# EAGLE design stm32f76XV_breakout (EAGLE 8.0.0)

## Sheet 1 of 2: STM32F4
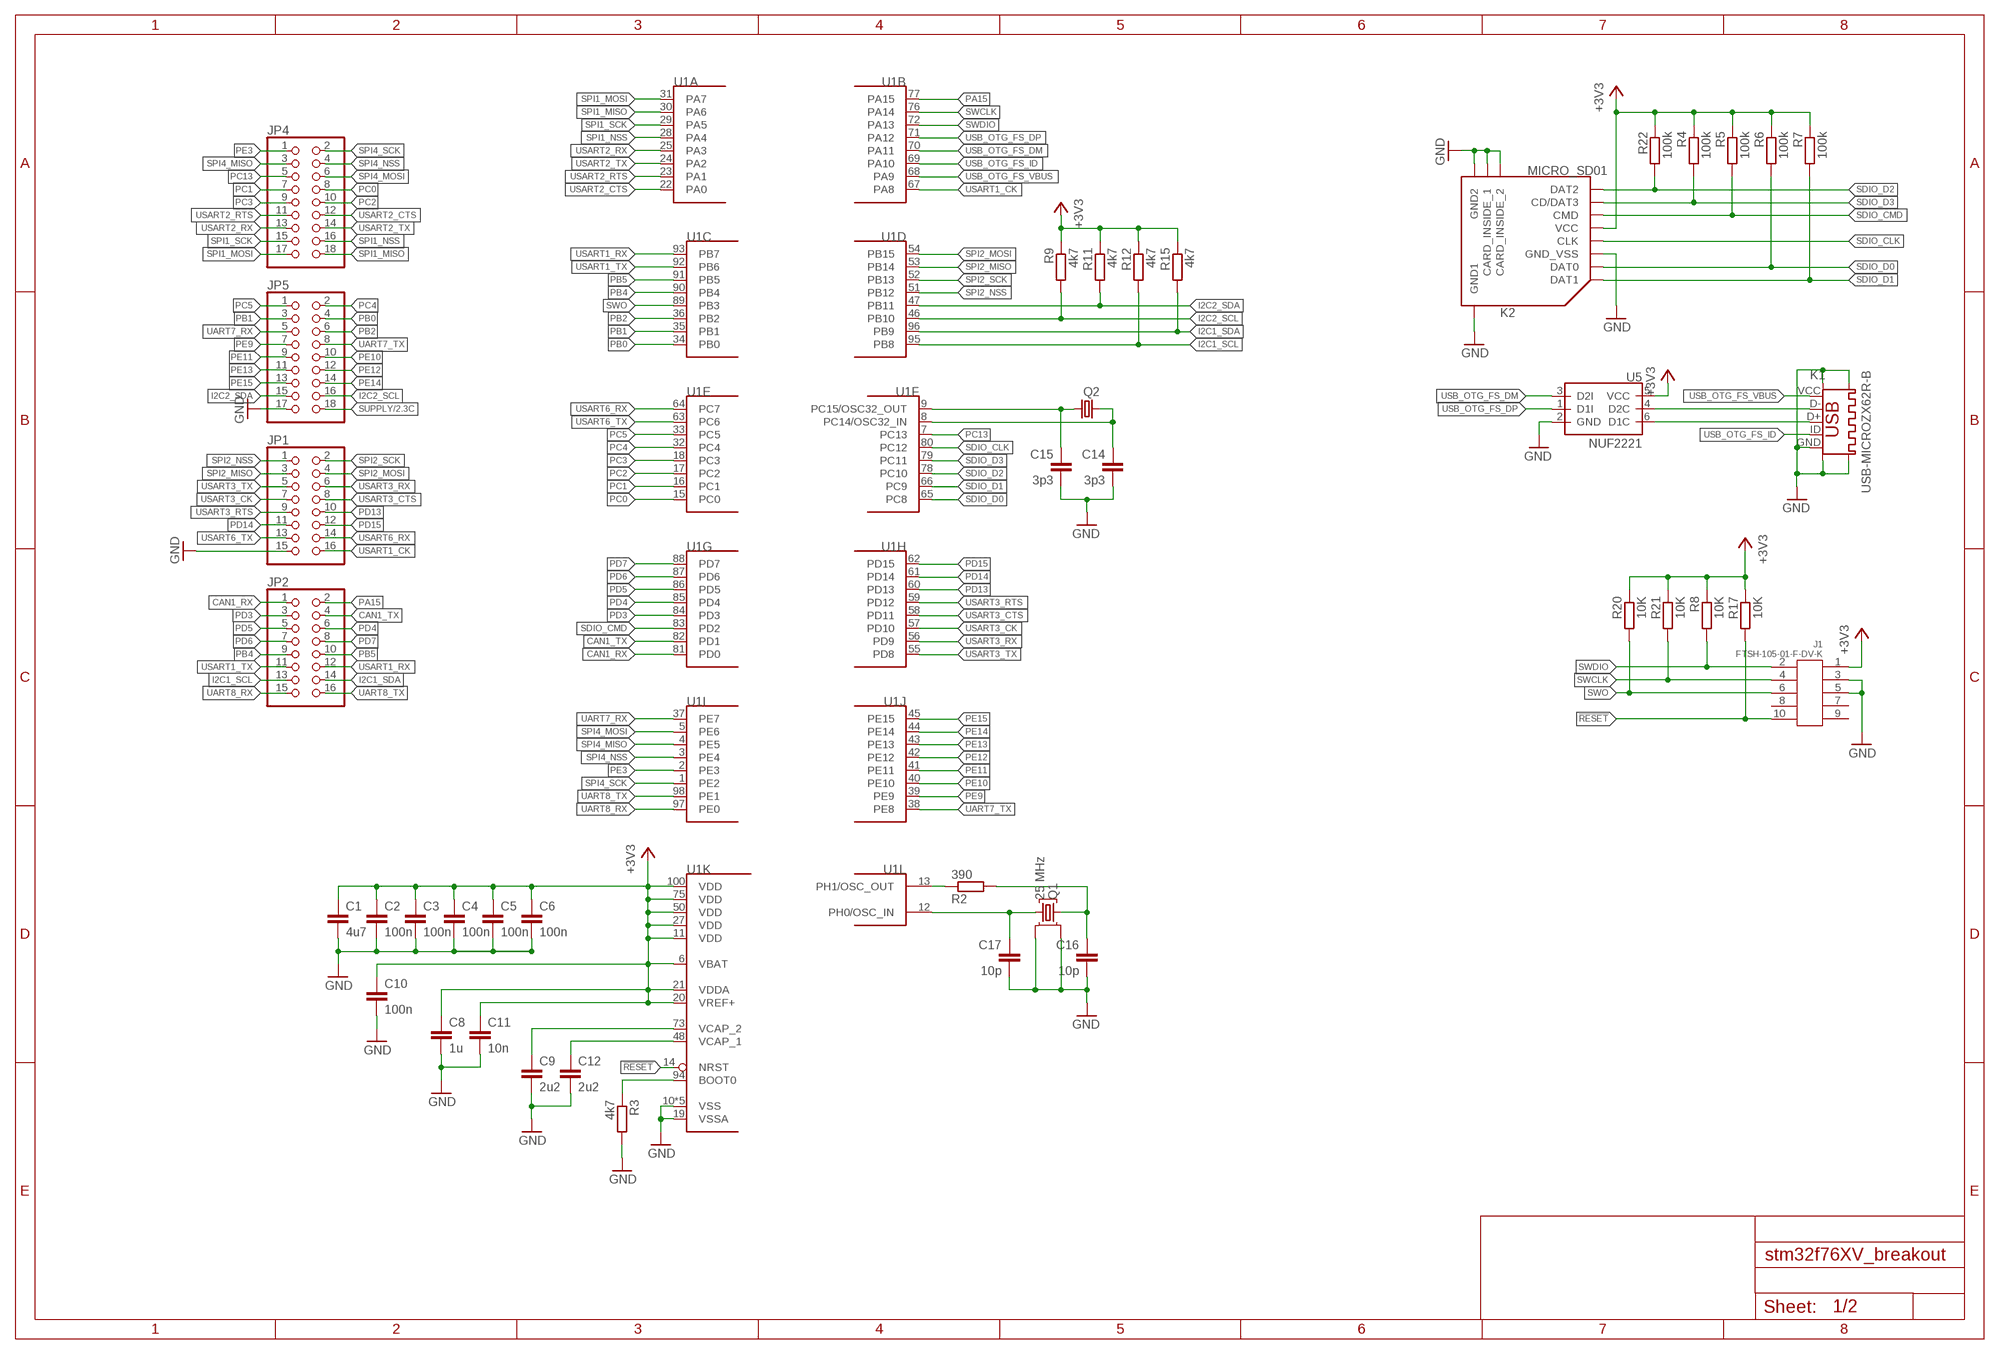
[diagram p0: schematic, sheet 1]

### Parts
C1  4u7  C-EUC0603  [C0603]
C2  100n  C-EUC0603  [C0603]
C3  100n  C-EUC0603  [C0603]
C4  100n  C-EUC0603  [C0603]
C5  100n  C-EUC0603  [C0603]
C6  100n  C-EUC0603  [C0603]
C8  1u  C-EUC0603  [C0603]
C9  2u2  C-EUC0603  [C0603]
C10  100n  C-EUC0603  [C0603]
C11  10n  C-EUC0603  [C0603]
C12  2u2  C-EUC0603  [C0603]
C14  3p3  C-EUC0603  [C0603]
C15  3p3  C-EUC0603  [C0603]
C16  10p  C-EUC0603  [C0603]
C17  10p  C-EUC0603  [C0603]
J1  FTSH-105-01-F-DV-K  [FTSH-105-01-XXX-DV-K]
JP1  PINHD-2X8  [2X08]
JP2  PINHD-2X8  [2X08]
JP4  PINHD-2X9  [2X09]
JP5  PINHD-2X9  [2X09]
K1  USB-MICROZX62R-B  [ZX62R-B]
K2  MICRO_SD01  [MICRO_SD_473093751]
Q1  25 MHz  CRYSTAL2M_CX32  [3.2X2.5MM-SMD]
Q2  CRYSTAL_ECX-34S  [3.2X1.5MM-SMD]
R2  390  R-EU_R0603  [R0603]
R3  4k7  R-EU_R0603  [R0603]
R4  100k  R-EU_R0603  [R0603]
R5  100k  R-EU_R0603  [R0603]
R6  100k  R-EU_R0603  [R0603]
R7  100k  R-EU_R0603  [R0603]
R8  10K  R-EU_R0603  [R0603]
R9  4k7  R-EU_R0603  [R0603]
R11  4k7  R-EU_R0603  [R0603]
R12  4k7  R-EU_R0603  [R0603]
R15  4k7  R-EU_R0603  [R0603]
R17  10K  R-EU_R0603  [R0603]
R20  10K  R-EU_R0603  [R0603]
R21  10K  R-EU_R0603  [R0603]
R22  100k  R-EU_R0603  [R0603]
U1  STM32F76XVXT  [LQFP-100_14X14MM]
U5  NUF2221  [SOT363]

### Nets
!RESET: J1.10 R17.2 U1.14(K:NRST)
+3V3: C1.1 C2.1 C3.1 C4.1 C5.1 C6.1 C8.1 C10.1 C11.1 J1.1 K2.VCC R4.1 R5.1 R6.1 R7.1 R8.1 R9.1 R11.1 R12.1 R15.1 R17.1 R20.1 R21.1 R22.1 U1.6(K:VBAT) U1.11(K:VDD) U1.20(K:VREF+) U1.21(K:VDDA) U1.27(K:VDD) U1.50(K:VDD) U1.75(K:VDD) U1.100(K:VDD) U5.5(VCC) ; also sheet 2
CAN1_RX: JP2.1 U1.81(G:PD0)
CAN1_TX: JP2.4 U1.82(G:PD1)
GND: C1.2 C2.2 C3.2 C4.2 C5.2 C6.2 C8.2 C9.2 C10.2 C11.2 C12.2 C14.2 C15.2 C16.2 C17.2 J1.3 J1.5 JP1.15 JP5.17 K1.GND K1.P$6(GND3) K1.P$7(GND4) K1.P$8(GND1) K1.P$9(GND2) K2.C_SW1(CARD_INSIDE_1) K2.C_SW2(CARD_INSIDE_2) K2.GND1 K2.GND2 K2.GND_VSS Q1.2(GND1) Q1.4(GND2) R3.2 U1.10(K:VSS) U1.19(K:VSSA) U1.26(K:VSS) U1.49(K:VSS) U1.74(K:VSS) U1.99(K:VSS) U5.2(GND) ; also sheet 2
I2C1_SCL: JP2.13 R12.2 U1.95(D:PB8)
I2C1_SDA: JP2.14 R15.2 U1.96(D:PB9)
I2C2_SCL: JP5.16 R9.2 U1.46(D:PB10)
I2C2_SDA: JP5.15 R11.2 U1.47(D:PB11)
N$1: C9.1 U1.73(K:VCAP_2)
N$2: C12.1 U1.48(K:VCAP_1)
N$3: R2.1 U1.13(L:PH1/OSC_OUT)
N$4: C17.1 Q1.3(Q2) U1.12(L:PH0/OSC_IN)
N$6: R3.1 U1.94(K:BOOT0)
N$21: C15.1 Q2.Q2 U1.9(F:PC15/OSC32_OUT)
N$22: C14.1 Q2.Q1 U1.8(F:PC14/OSC32_IN)
N$24: C16.1 Q1.1(Q1) R2.2
PA15: JP2.2 U1.77(B:PA15)
PB0: JP5.4 U1.34(C:PB0)
PB1: JP5.3 U1.35(C:PB1)
PB2: JP5.6 U1.36(C:PB2)
PB4: JP2.9 U1.90(C:PB4)
PB5: JP2.10 U1.91(C:PB5)
PC0: JP4.8 U1.15(E:PC0)
PC1: JP4.7 U1.16(E:PC1)
PC2: JP4.10 U1.17(E:PC2)
PC3: JP4.9 U1.18(E:PC3)
PC4: JP5.2 U1.32(E:PC4)
PC5: JP5.1 U1.33(E:PC5)
PC13: JP4.5 U1.7(F:PC13)
PD3: JP2.3 U1.84(G:PD3)
PD4: JP2.6 U1.85(G:PD4)
PD5: JP2.5 U1.86(G:PD5)
PD6: JP2.7 U1.87(G:PD6)
PD7: JP2.8 U1.88(G:PD7)
PD13: JP1.10 U1.60(H:PD13)
PD14: JP1.11 U1.61(H:PD14)
PD15: JP1.12 U1.62(H:PD15)
PE3: JP4.1 U1.2(I:PE3)
PE9: JP5.7 U1.39(J:PE9)
PE10: JP5.10 U1.40(J:PE10)
PE11: JP5.9 U1.41(J:PE11)
PE12: JP5.12 U1.42(J:PE12)
PE13: JP5.11 U1.43(J:PE13)
PE14: JP5.14 U1.44(J:PE14)
PE15: JP5.13 U1.45(J:PE15)
SDIO_CLK: K2.CLK U1.80(F:PC12)
SDIO_CMD: K2.CMD R5.2 U1.83(G:PD2)
SDIO_D0: K2.DAT0 R6.2 U1.65(F:PC8)
SDIO_D1: K2.DAT1 R7.2 U1.66(F:PC9)
SDIO_D2: K2.DAT2 R22.2 U1.78(F:PC10)
SDIO_D3: K2.CD/DAT3 R4.2 U1.79(F:PC11)
SPI1_MISO: JP4.18 U1.30(A:PA6)
SPI1_MOSI: JP4.17 U1.31(A:PA7)
SPI1_NSS: JP4.16 U1.28(A:PA4)
SPI1_SCK: JP4.15 U1.29(A:PA5)
SPI2_MISO: JP1.3 U1.53(D:PB14)
SPI2_MOSI: JP1.4 U1.54(D:PB15)
SPI2_NSS: JP1.1 U1.51(D:PB12)
SPI2_SCK: JP1.2 U1.52(D:PB13)
SPI4_MISO: JP4.3 U1.4(I:PE5)
SPI4_MOSI: JP4.6 U1.5(I:PE6)
SPI4_NSS: JP4.4 U1.3(I:PE4)
SPI4_SCK: JP4.2 U1.1(I:PE2)
SUPPLY: JP5.18 ; also sheet 2
SWCLK: J1.4 R21.2 U1.76(B:PA14)
SWDIO: J1.2 R8.2 U1.72(B:PA13)
SWO: J1.6 R20.2 U1.89(C:PB3)
UART7_RX: JP5.5 U1.37(I:PE7)
UART7_TX: JP5.8 U1.38(J:PE8)
UART8_RX: JP2.15 U1.97(I:PE0)
UART8_TX: JP2.16 U1.98(I:PE1)
USART1_CK: JP1.16 U1.67(B:PA8)
USART1_RX: JP2.12 U1.93(C:PB7)
USART1_TX: JP2.11 U1.92(C:PB6)
USART2_CTS: JP4.12 U1.22(A:PA0)
USART2_RTS: JP4.11 U1.23(A:PA1)
USART2_RX: JP4.13 U1.25(A:PA3)
USART2_TX: JP4.14 U1.24(A:PA2)
USART3_CK: JP1.7 U1.57(H:PD10)
USART3_CTS: JP1.8 U1.58(H:PD11)
USART3_RTS: JP1.9 U1.59(H:PD12)
USART3_RX: JP1.6 U1.56(H:PD9)
USART3_TX: JP1.5 U1.55(H:PD8)
USART6_RX: JP1.14 U1.64(E:PC7)
USART6_TX: JP1.13 U1.63(E:PC6)
USB_DM: K1.D- U5.4(D2C)
USB_DP: K1.D+ U5.6(D1C)
USB_OTG_FS_DM: U1.70(B:PA11) U5.3(D2I)
USB_OTG_FS_DP: U1.71(B:PA12) U5.1(D1I)
USB_OTG_FS_ID: K1.ID U1.69(B:PA10)
USB_OTG_FS_VBUS: K1.VCC U1.68(B:PA9)
Unconnected: J1.7 J1.8 J1.9

## Sheet 2 of 2
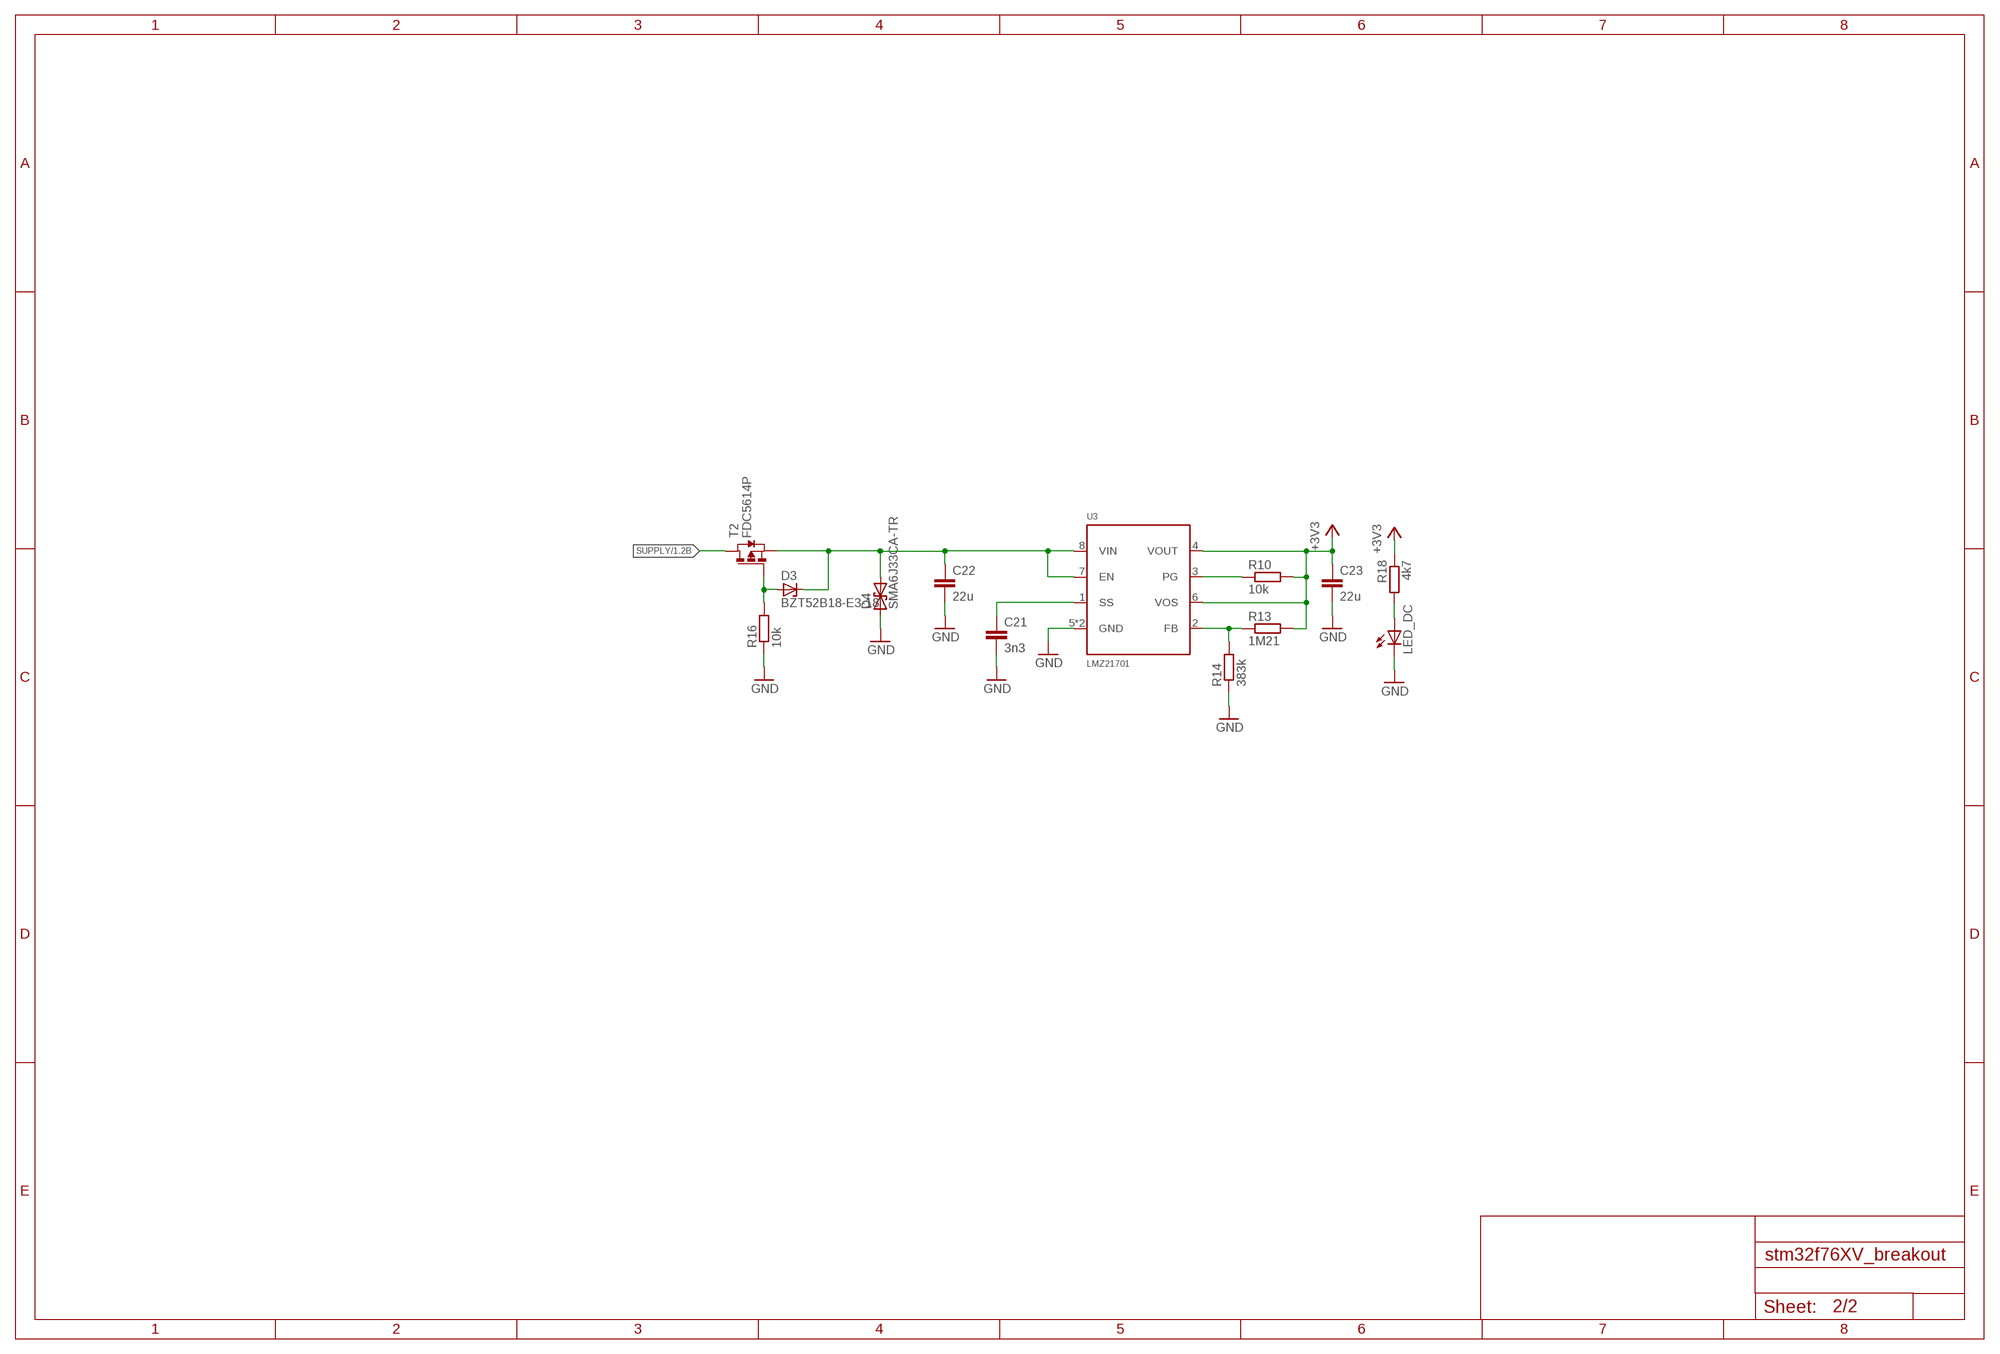
[diagram p1: schematic, sheet 2]

### Parts
C21  3n3  C-EUC0603  [C0603]
C22  22u  C-EUC1210  [C1210]
C23  22u  C-EUC1210  [C1210]
D3  BZT52B18-E3-18  ZENER_SOD123  [SOD123F]
D4  SMA6J33CA-TR  [DO214AC]
LED_DC  LEDCHIPLED_0603  [CHIPLED_0603]
R10  10k  R-EU_R0603  [R0603]
R13  1M21  R-EU_R0603  [R0603]
R14  383k  R-EU_R0603  [R0603]
R16  10k  R-EU_R0603  [R0603]
R18  4k7  R-EU_R0603  [R0603]
T2  FDC5614P  [SSOT6]
U3  LMZ21701  [SIL0008E]

### Nets
+3V3: C23.1 R10.2 R13.2 R18.1 U3.4(VOUT) U3.6(VOS) ; also sheet 1
GND: C21.2 C22.2 C23.2 D4.A LED_DC.C R14.1 R16.1 U3.5(GND) U3.PAD(GND) ; also sheet 1
LMZ_FB: R13.1 R14.2 U3.2(FB)
LMZ_PG: R10.1 U3.3(PG)
LMZ_SS: C21.1 U3.1(SS)
LMZ_VIN: C22.1 D3.C D4.C T2.4(S) U3.7(EN) U3.8(VIN)
N$5: LED_DC.A R18.2
N$36: D3.A R16.2 T2.3(G)
SUPPLY: T2.1(D) T2.2(D) T2.5(D) T2.6(D) ; also sheet 1

## Library data of the parts
C1-C6 C8-C12 C21-C23 = rcl:C-EU: CAPACITOR, European symbol
C14-C17 = rcl:C-EU: CAPACITOR, European symbol; DISTRIBUTOR: Digikey; OC_DIGIKEY: 445-1769-1-ND; ORDER_CODE: 445-1769-1-ND
D3 = usr_diode:ZENER_SOD123; DISTRIBUTOR: Mouser; OC_MOUSER: 78-BZT52B18-E3-18; ORDER_CODE: 78-BZT52B18-E3-18
D4 = usr_diode:SMA6J33CA-TR; DISTRIBUTOR: Mouser; OC_MOUSER: 511-SMA6J33CA-TR; ORDER_CODE: 511-SMA6J33CA-TR
J1 = samtec:FTSH-105-01-*-DV-K
JP1 JP2 = pinhead:PINHD-2X8: PIN HEADER
JP4 JP5 = pinhead:PINHD-2X9: PIN HEADER
K1 = usr_hirose-electric:USB-MICRO: Micro B - Reverse (Top mount) Shell SMT Source: http://media.digikey.com/PDF/Data%20Sheets/Hirose%20PDFs/ZX62R-B-5P.pdf; DISTRIBUTOR: Digikey; OC_DIGIKEY: H11574CT-ND; ORDER_CODE: H11574CT-ND
K2 = usr_gerneral:MICRO_SD01; DISTRIBUTOR: RS-Components; OC_FARNELL: 1568092; OC_RS-COMPONENTS: 702-5485; ORDER_CODE: 702-5485
LED_DC = led:LED: LED OSRAM: - CHIPLED LG R971, LG N971, LY N971, LG Q971, LY Q971, LO R971, LY R971 LH N974, LH R974 LS Q976, LO Q976, LY Q976 LO Q996 - Hyper CHIPLED LW Q18S LB Q993, LB Q99A, LB R99A - SideLED LS A670, LO A670, LY A670, LG A670, LP A670 LB A673, LV A673, LT A673, LW A673 LH A674 LY A675 LS A676, LA A676, LO A676, LY A676, LW A676 LS A679, LY A679, LG A679 - Hyper Micro SIDELED® LS Y876, LA Y876, LO Y876, LY Y876 LT Y87S - SmartLED LW L88C, LW L88S LB L89C, LB L89S, LG L890 LS L89K, LO L89K, LY L89K LS L896, LA L896, LO L896, LY L896 - TOPLED LS T670, LO T670, LY T670, LG T670, LP T670 LSG T670, LSP T670, LSY T670, LOP T670, LYG T670 LG T671, LOG T671, LSG T671 LB T673, LV T673, LT T673, LW T673 LH T674 LS T676, LA T676, LO T676, LY T676, LB T676, LH T676, LSB T676, LW T676 LB T67C, LV T67C, LT T67C, LS T67K, LO T67K, LY T67K, LW E67C LS E67B, LA E67B, LO E67B, LY E67B, LB E67C, LV E67C, LT E67C LW T67C LS T679, LY T679, LG T679 LS T770, LO T770, LY T770, LG T770, LP T770 LB T773, LV T773, LT T773, LW T773 LH T774 LS E675, LA E675, LY E675, LS T675 LS T776, LA T776, LO T776, LY T776, LB T776 LHGB T686 LT T68C, LB T68C - Hyper Mini TOPLED® LB M676 - Mini TOPLED Santana® LG M470 LS M47K, LO M47K, LY M47K Source: http://www.osram.convergy.de LUXEON: - LUMILED® LXK2-PW12-R00, LXK2-PW12-S00, LXK2-PW14-U00, LXK2-PW14-V00 LXK2-PM12-R00, LXK2-PM12-S00, LXK2-PM14-U00 LXK2-PE12-Q00, LXK2-PE12-R00, LXK2-PE12-S00, LXK2-PE14-T00, LXK2-PE14-U00 LXK2-PB12-K00, LXK2-PB12-L00, LXK2-PB12-M00, LXK2-PB14-N00, LXK2-PB14-P00, LXK2-PB14-Q00 LXK2-PR12-L00, LXK2-PR12-M00, LXK2-PR14-Q00, LXK2-PR14-R00 LXK2-PD12-Q00, LXK2-PD12-R00, LXK2-PD12-S00 LXK2-PH12-R00, LXK2-PH12-S00 LXK2-PL12-P00, LXK2-PL12-Q00, LXK2-PL12-R00 Source: www.luxeon.com KINGBRIGHT: KA-3528ASYC Source: www.kingbright.com; DISTRIBUTOR: RS-Components; OC_RS-COMPONENTS: 665-6090; ORDER_CODE: 665-6090
Q1 = usr_crystal:CRYSTAL2M*: Crystal Source: ABM11 Series <http://www.abracon.com/Resonators/ABM11.pdf>; DISTRIBUTOR: Digikey; OC_DIGIKEY: 644-1266-1-ND; ORDER_CODE: 644-1266-1-ND
Q2 = usr_crystal:CRYSTAL*: CRYSTAL Source: ECX-12 Serie <http://www.ecsxtal.com/store/pdf/ECX_12.pdf>; DISTRIBUTOR: Digikey; OC_DIGIKEY: XC1935CT-ND; ORDER_CODE: XC1935CT-ND
R2 R3 R10 R13 R14 = rcl:R-EU_: RESISTOR, European symbol; DISTRIBUTOR: Digikey; OC_DIGIKEY: P390AGCT-ND; ORDER_CODE: P390AGCT-ND
R4-R9 R11 R12 R15 R17 R18 R20-R22 = rcl:R-EU_: RESISTOR, European symbol
R16 = rcl:R-EU_: RESISTOR, European symbol; DISTRIBUTOR: Mouser; OC_MOUSER: 71-CRCW0402-10K-E3; ORDER_CODE: 71-CRCW0402-10K-E3
T2 = usr_gerneral:FDC5614P: 60V P-Channel MOSFET Id -3A Vds -60V Vgs -20V; DISTRIBUTOR: Mouser; OC_MOUSER: 512-FDC5614P; ORDER_CODE: 512-FDC5614P
U1 = STMicroelectronics:STM32F76XVXT; DISTRIBUTOR: RS; ORDER_CODE: 111-6469
U3 = ti:LMZ2170*: LMZ2170X 1 A SIMPLE SWITCHER® Nano Module with 17 V Maximum Input Voltage; DISTRIBUTOR: RS; ORDER_CODE: 798-1212
U5 = usr_on-semiconductor:NUF2221: USB Upstream Terminator with ESD Protection http://www.onsemi.com/pub_link/Collateral/NUF2221W1T2-D.PDF; DISTRIBUTOR: Digikey; OC_DIGIKEY: NUF2221W1T2GOSCT-ND; ORDER_CODE: NUF2221W1T2GOSCT-ND

## Board
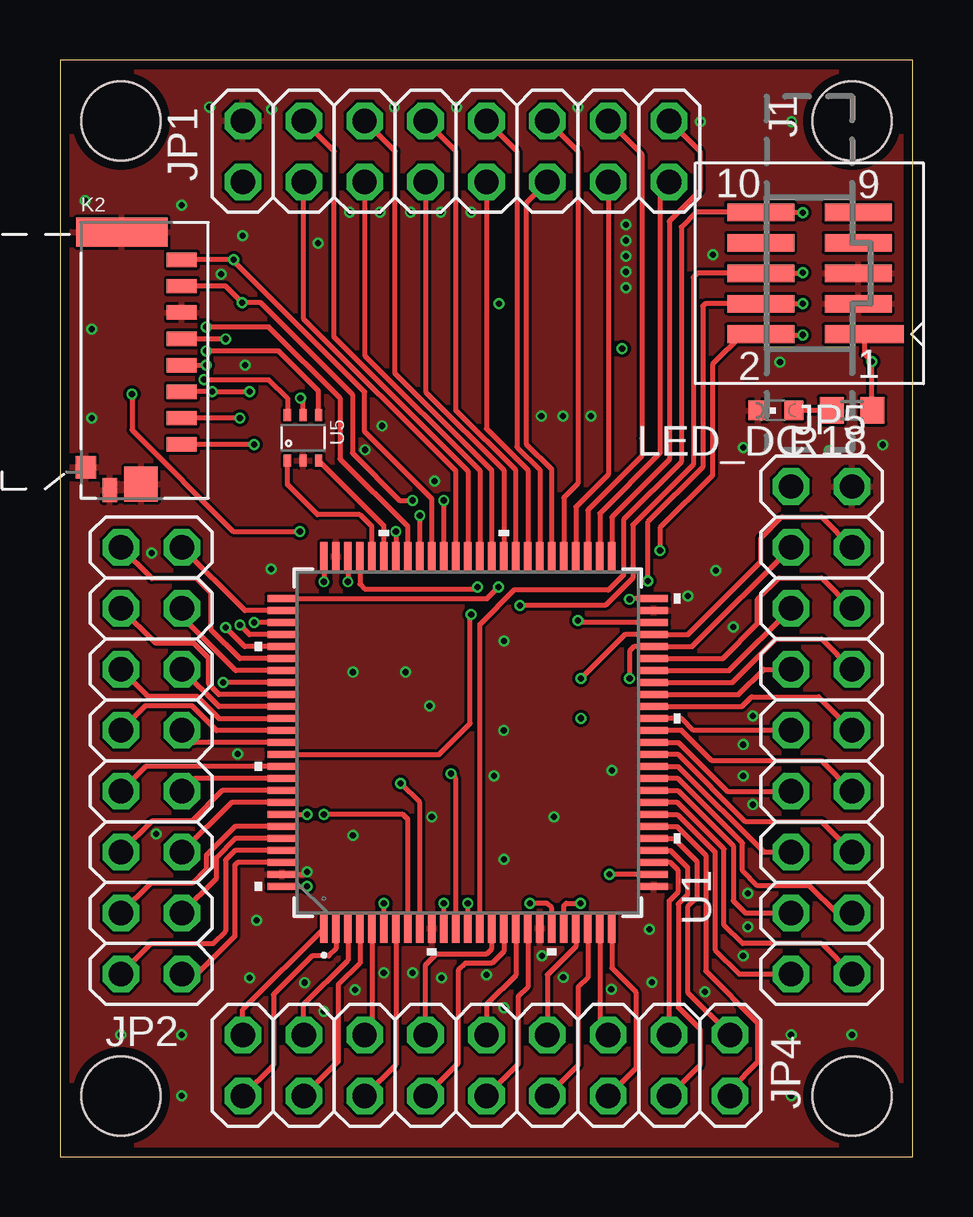
[diagram p2: board, top side]
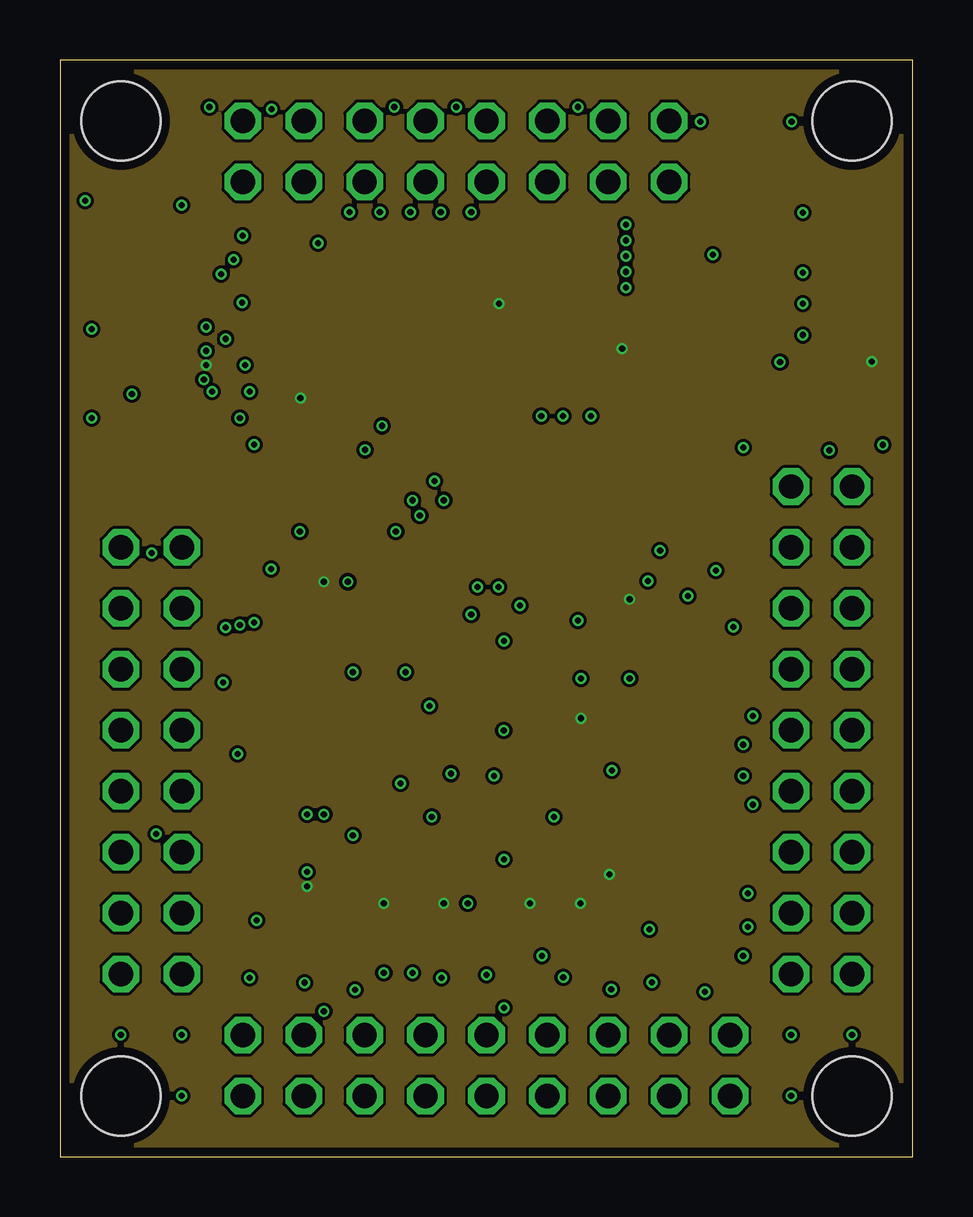
[diagram p3: board, inner layer Route2]
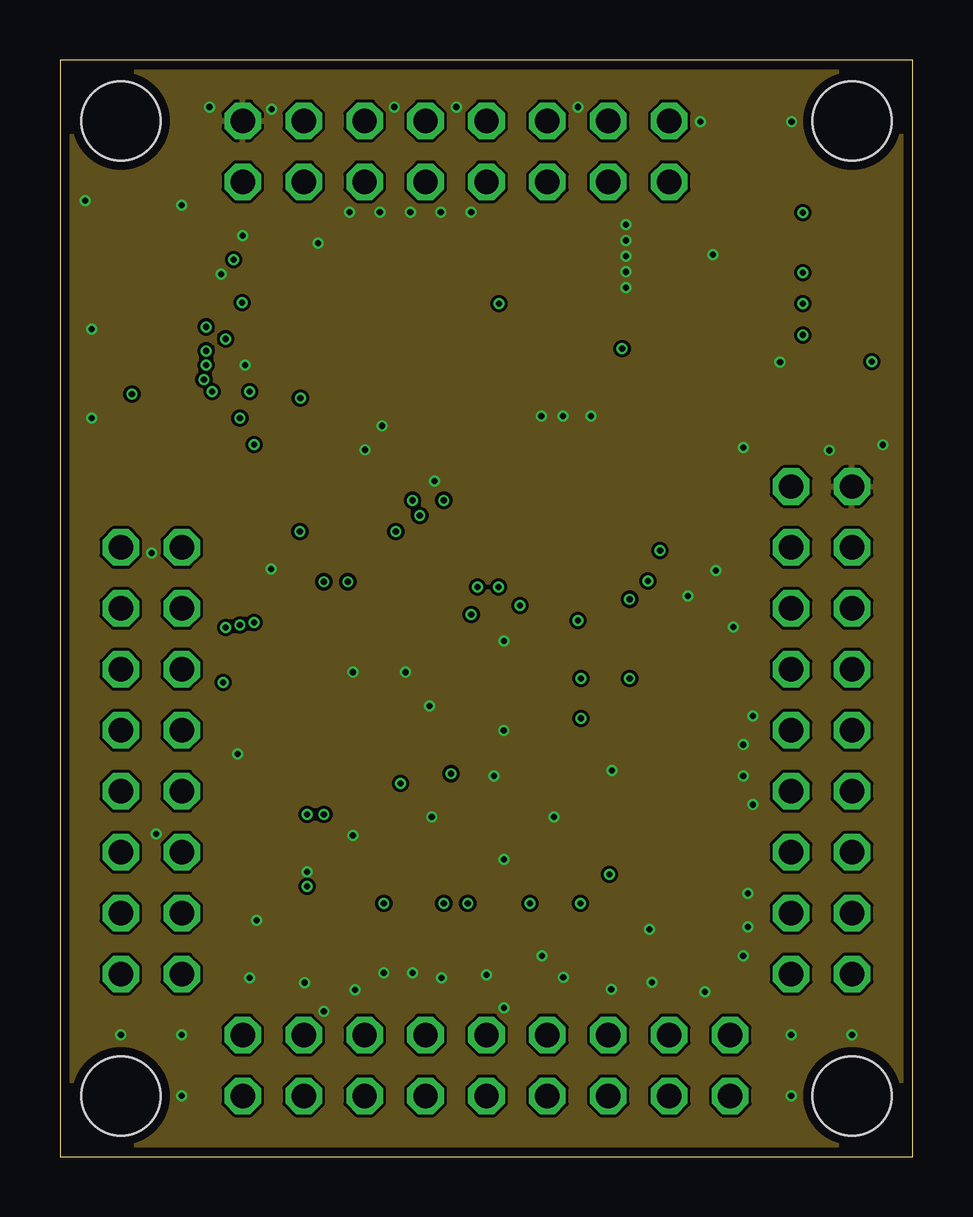
[diagram p4: board, inner layer Route15]
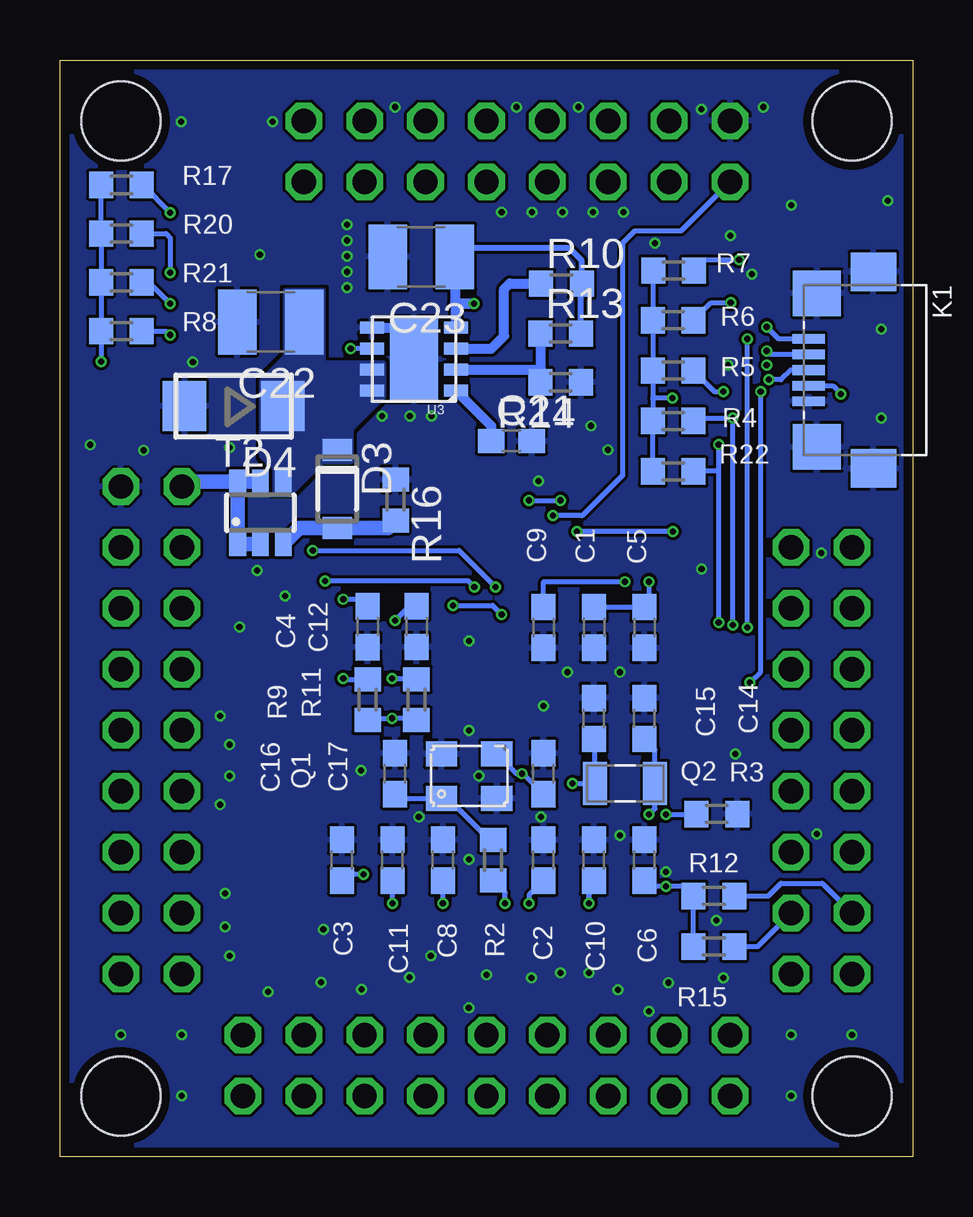
[diagram p5: board, bottom side, seen from below]

Size 35.56 x 45.72 mm. Coordinates in mm from the lower left corner, seen from the top.
Outline: 0,0 35.56,0 35.56,45.72 0,45.72 0,0
Copper layers (1+2*15+16): Top 0.035559375mm / dielectric 0.17018125mm / Route2 0.01778125mm / dielectric 47mil / Route15 0.01778125mm / dielectric 0.17018125mm / Bottom 0.035559375mm
Design rules "osh-park-4layer *": minimum track width 5mil, minimum drill 10mil, track to track 5mil, track to pad 5mil, pad to pad 5mil, via to via 5mil, smd to smd 5mil, copper to edge 15mil, drill to drill 5mil, minimum pad ring 7mil, minimum via ring 4mil, stop-mask expansion 3mil, vias tented up to drill 0mil, thermal gap 5mil
Holes 3.3 mm at 33.02,43.18 33.02,2.54 2.54,43.18 2.54,2.54

### Footprints (pad centres in the part's own frame; a part is rotated, then mirrored left to right if it is on the bottom)
C0603 = smd 1.1 x 1: 1 -0.85,0; 2 0.85,0
C1210 = smd 1.6 x 2.7: 1 -1.4,0; 2 1.4,0
SOD123F = smd 0.91 x 1.22: A 1.625,0; C -1.625,0
DO214AC = smd 1.8 x 2.1: A 2.05,0; C -2.05,0
FTSH-105-01-XXX-DV-K = smd 0.737 x 3.302: 1 2.54,2.286 | smd 0.737 x 2.794: 2 2.54,-2.032; 3 1.27,2.032; 4 1.27,-2.032; 5 0,2.032; 6 0,-2.032; 7 -1.27,2.032; 8 -1.27,-2.032; 9 -2.54,2.032; 10 -2.54,-2.032
2X08 = drill 1.016 octagon: 1 -8.89,-1.27; 2 -8.89,1.27; 3 -6.35,-1.27; 4 -6.35,1.27; 5 -3.81,-1.27; 6 -3.81,1.27; 7 -1.27,-1.27; 8 -1.27,1.27; 9 1.27,-1.27; 10 1.27,1.27; 11 3.81,-1.27; 12 3.81,1.27; 13 6.35,-1.27; 14 6.35,1.27; 15 8.89,-1.27; 16 8.89,1.27
2X09 = drill 1.016 octagon: 1 -10.16,-1.27; 2 -10.16,1.27; 3 -7.62,-1.27; 4 -7.62,1.27; 5 -5.08,-1.27; 6 -5.08,1.27; 7 -2.54,-1.27; 8 -2.54,1.27; 9 0,-1.27; 10 0,1.27; 11 2.54,-1.27; 12 2.54,1.27; 13 5.08,-1.27; 14 5.08,1.27; 15 7.62,-1.27; 16 7.62,1.27; 17 10.16,-1.27; 18 10.16,1.27
ZX62R-B = smd 1.35 x 0.4: D+ 2.35,0; D- 2.35,-0.65; GND 2.35,1.3; ID 2.35,0.65; VCC 2.35,-1.3 | smd 2 x 1.9: P$6 2,-3.2; P$8 2,3.2 | smd 1.9 x 1.6: P$7 -0.35,-4.1; P$9 -0.35,4.1
MICRO_SD_473093751 = smd 0.6 x 1: C_SW1 -3,-5.75 | smd 0.85 x 0.95: C_SW2 -4,-4.8 | smd 1.25 x 0.6: CD/DAT3 0,-2.75; CLK 0,0.55; CMD 0,-1.65; DAT0 0,2.75; DAT1 0,3.85; DAT2 0,-3.85; GND_VSS 0,1.65; VCC 0,-0.55 | smd 3.8 x 1.2: GND1 -2.5,5 | smd 1.4 x 1.45: GND2 -1.7,-5.5
CHIPLED_0603 = smd 0.8 x 0.8: A 0,-0.75; C 0,0.75
3.2X2.5MM-SMD = smd 1.3 x 1.05: 1 1.15,0.925; 2 -1.15,0.925; 3 -1.15,-0.925; 4 1.15,-0.925
3.2X1.5MM-SMD = smd 1 x 1.8: Q1 -1.25,0; Q2 1.25,0
R0603 = smd 1 x 1.1: 1 -0.85,0; 2 0.85,0
SSOT6 = smd 0.69 x 0.99: 1 -0.95,-1.3; 2 0,-1.3; 3 0.95,-1.3; 4 0.95,1.3; 5 0,1.3; 6 -0.95,1.3
LQFP-100_14X14MM = smd 1.2 x 0.3: 1 -7.75,6; 2 -7.75,5.5; 3 -7.75,5; 4 -7.75,4.5; 5 -7.75,4; 6 -7.75,3.5; 7 -7.75,3; 8 -7.75,2.5; 9 -7.75,2; 10 -7.75,1.5; 11 -7.75,1; 12 -7.75,0.5; 13 -7.75,0; 14 -7.75,-0.5; 15 -7.75,-1; 16 -7.75,-1.5; 17 -7.75,-2; 18 -7.75,-2.5; 19 -7.75,-3; 20 -7.75,-3.5; 21 -7.75,-4; 22 -7.75,-4.5; 23 -7.75,-5; 24 -7.75,-5.5; 25 -7.75,-6; 51 7.75,-6; 52 7.75,-5.5; 53 7.75,-5; 54 7.75,-4.5; 55 7.75,-4; 56 7.75,-3.5; 57 7.75,-3; 58 7.75,-2.5; 59 7.75,-2; 60 7.75,-1.5; 61 7.75,-1; 62 7.75,-0.5; 63 7.75,0; 64 7.75,0.5; 65 7.75,1; 66 7.75,1.5; 67 7.75,2; 68 7.75,2.5; 69 7.75,3; 70 7.75,3.5; 71 7.75,4; 72 7.75,4.5; 73 7.75,5; 74 7.75,5.5; 75 7.75,6 | smd 0.3 x 1.2: 26 -6,-7.75; 27 -5.5,-7.75; 28 -5,-7.75; 29 -4.5,-7.75; 30 -4,-7.75; 31 -3.5,-7.75; 32 -3,-7.75; 33 -2.5,-7.75; 34 -2,-7.75; 35 -1.5,-7.75; 36 -1,-7.75; 37 -0.5,-7.75; 38 0,-7.75; 39 0.5,-7.75; 40 1,-7.75; 41 1.5,-7.75; 42 2,-7.75; 43 2.5,-7.75; 44 3,-7.75; 45 3.5,-7.75; 46 4,-7.75; 47 4.5,-7.75; 48 5,-7.75; 49 5.5,-7.75; 50 6,-7.75; 76 6,7.75; 77 5.5,7.75; 78 5,7.75; 79 4.5,7.75; 80 4,7.75; 81 3.5,7.75; 82 3,7.75; 83 2.5,7.75; 84 2,7.75; 85 1.5,7.75; 86 1,7.75; 87 0.5,7.75; 88 0,7.75; 89 -0.5,7.75; 90 -1,7.75; 91 -1.5,7.75; 92 -2,7.75; 93 -2.5,7.75; 94 -3,7.75; 95 -3.5,7.75; 96 -4,7.75; 97 -4.5,7.75; 98 -5,7.75; 99 -5.5,7.75; 100 -6,7.75
SIL0008E = smd 1 x 0.5: 1 -1.75,1.312; 2 -1.75,0.438; 3 -1.75,-0.438; 4 -1.75,-1.312; 5 1.75,-1.312; 6 1.75,-0.438; 7 1.75,0.438; 8 1.75,1.312 | smd 2 x 3.5: PAD 0,0
SOT363 = smd 0.3 x 0.5: 1 0.65,0.95; 2 0,0.95; 3 -0.65,0.95; 4 -0.65,-0.95; 5 0,-0.95; 6 0.65,-0.95

### Placement (x,y rotation side)
C1  13.3,22.07 270 bottom
C2  15.4,12.37 90 bottom
C3  23.8,12.37 90 bottom
C4  22.73,22.1 270 bottom
C5  11.2,22.07 270 bottom
C6  11.2,12.37 90 bottom
C8  19.6,12.37 90 bottom
C9  15.4,22.07 270 bottom
C10  13.3,12.37 90 bottom
C11  21.7,12.37 90 bottom
C12  20.7,22.1 270 bottom
C14  11.2,18.27 90 bottom
C15  13.3,18.27 90 bottom
C16  21.6,15.97 90 bottom
C17  15.4,15.97 90 bottom
C21  16.74,29.84 0 bottom
C22  26.77,34.8 180 bottom
C23  20.5,37.52 180 bottom
D3  24,27.84 270 bottom
D4  28.32,31.29 180 bottom
J1  31.24,36.83 270 top
JP1  16.51,41.91 180 top
JP2  3.81,16.51 270 top
JP4  17.78,3.81 0 top
JP5  31.75,17.78 90 top
K1  2,32.79 180 bottom
K2  5.08,33.54 0 top
LED_DC  29.84,31.11 90 top
Q1  18.5,15.87 180 bottom
Q2  12,15.57 180 bottom
R2  17.5,12.37 90 bottom
R3  8.18,14.29 0 bottom
R4  10,30.67 0 bottom
R5  10,32.77 0 bottom
R6  10,34.87 0 bottom
R7  9.98,36.94 0 bottom
R8  32.99,34.42 0 bottom
R9  22.73,19.05 90 bottom
R10  14.66,36.4 0 bottom
R11  20.7,19.05 90 bottom
R12  8.3,10.87 0 bottom
R13  14.68,34.32 0 bottom
R14  14.68,32.28 180 bottom
R15  8.3,8.77 0 bottom
R16  21.56,27.38 270 bottom
R17  32.99,40.51 0 bottom
R18  33.02,31.11 180 top
R20  32.99,38.48 0 bottom
R21  32.99,36.45 0 bottom
R22  10,28.57 0 bottom
T2  27.2,26.85 0 bottom
U1  17,17.27 90 top
U3  20.8,33.25 180 bottom
U5  10.13,29.97 180 top

### Tracks (layer width: path | path; a pad name or v marks a point on that pad's centre or on a via)
!RESET  (via drill 0.25)
  Top 0.2: U1.14 17.5,22.2 18.92,23.62 22.86,23.62 23.5,24.26 23.5,26.55 25.9,28.96 25.9,38.76 26.51,39.37 J1.10 v30.95,39.37 v30.96,39.36
  Bottom 0.2: R17.2 32.12,40.51 v30.96,39.36
+3V3  (via drill 0.25)
  Top 0.127: R18.1 33.84,31.14 v33.84,33.16
  Top 0.2: U1.6 v13.5,10.57 | U1.100 v10.3,11.27 | U1.11 v16,10.57 | U1.20 20.5,10.37 20.3,10.57 v19.6,10.57 | U1.21 21,10.47 21.1,10.57 v21.7,10.57 | U1.27 v22.9,11.77 | K2.VCC v6.1,32.99 | U1.75 v11,23.97 | U5.5 10.13,31.51 v10.02,31.62 | U1.50 23.78,23.27 v23.75,23.24 | J1.1 33.53,33.47 v33.84,33.16 33.84,31.06
  Bottom 0.2: 13.5,11.02 v13.5,10.57 13.5,11.32 C10.1 | R15.1 R12.1 9.55,11.27 v10.3,11.27 10.85,11.27 11.1,11.52 C6.1 | C2.1 16,10.92 v16,10.57 | v19.6,10.57 C8.1 | v21.7,10.57 C11.1 | v22.9,11.77 23.55,11.77 C3.1 | v11,23.97 11,23.12 C5.1 C1.1 | R22.1 R4.1 | v23.75,23.24 23.13,23.24 22.83,22.95 C4.1 | R11.1 20.78,18.28 v21.72,18.28 22.65,18.28 R9.1 | R4.1 R5.1 R6.1 10.85,36.92 R7.1 | v10.02,31.62 10.85,31.62 R4.1 | R17.1 R20.1 R21.1 R8.1 v33.84,33.16 | U3.6 v23.44,33.69
  Bottom 0.254: R13.2 13.83,36.4 R10.2 13.81,37.35 14.33,37.87 18.74,37.87 C23.1
  Bottom 0.406: 19.08,37.5 C23.1 | C23.1 19.05,37.47 | U3.4 19.05,35.56 v18.3,35.56 19.1,35.56 C23.1
  pour Route2: -2.54,-2.54 38.1,-2.54 38.1,48.26 -2.54,48.26
CAN1_RX
  Top 0.2: U1.81 7.5,20.77 6.3,21.97 6.3,23.5 5.7,24.1 3.84,24.1 JP2.1
CAN1_TX
  Top 0.2: U1.82 7.33,20.27 5.08,22.52 JP2.4
GND  (via drill 0.25)
  Top 0.2: U1.99 10.2,11.77 v10.3,11.87
  Bottom 0.406: U3.5 20.8,34.56 U3.PAD
  other vias: 18.5,17.77 18.1,15.87 15.5,14.17 20.6,14.17 20.1,8.37 4.01,13.45 20.06,30.88 20.98,30.88 22.14,30.88 17.78,7.58 20.98,7.48 22.98,6.98 24.68,7.28 24.58,9.48 26.88,6.88 28.48,8.38 28.68,9.58 28.68,10.98 15.9,7.46 14.7,7.66 13.5,7.66 12.3,6.96 11,6.06 10.2,7.26 7.9,7.46 8.2,9.86 7.41,16.8 12.21,13.4 18.51,12.4 23.01,16.1 18.51,21.5 15.41,18.8 12.21,20.2 14.41,20.2 8.81,24.5 3.82,25.17 1.32,30.79 1.32,34.49 6.72,36.79 7.72,32.99 15.62,28.17 13.42,30.47 12.72,29.47 7.62,38.39 5.07,39.66 1.05,39.85 32.08,29.45 34.3,29.68 30.5,43.14 26.7,43.14 33.02,5.08 30.48,5.08 30.48,2.54 5.08,2.54 5.08,5.08 2.54,5.08 6.23,43.76 8.82,43.66 13.94,43.76 16.52,43.76 21.59,43.76 28.48,15.88 28.48,17.18 28.88,18.38 28.88,14.68 28.08,22.08 26.18,23.38 27.34,24.44 12.06,39.37 10.75,38.09 18.52,6.21 23.59,38.86 23.59,38.2 23.59,37.54 27.23,37.61 30.02,33.12 14.61,39.37 23.59,36.89 23.59,36.24 28.5,29.56 13.34,39.37 15.88,39.37 17.14,39.37
  pour Top: -2.54,-2.54 38.1,-2.54 38.1,48.26 -2.54,48.26
  pour Bottom (rank 2): -2.54,-2.54 38.1,-2.54 38.1,48.26 -2.54,48.26
  pour Route15: -2.54,-2.54 38.1,-2.54 38.1,48.26 -2.54,48.26
I2C1_SCL
  Top 0.2: U1.95 7.3,13.77 6.1,12.57 6.1,12 5.5,11.4 3.78,11.4 JP2.13
  Bottom 0.2: R12.2 6.03,10.87 5.5,11.4 3.78,11.4 JP2.13
I2C1_SDA
  Top 0.2: U1.96 7.3,13.27 6.5,12.47 6.5,11.58 JP2.14
  Bottom 0.2: R15.2 6.47,8.77 JP2.14
I2C2_SCL  (via drill 0.25)
  Top 0.2: v23.75,19.94 23.75,21.08 23.94,21.27 U1.46 26.35,21.27 JP5.16
  Bottom 0.2: v23.75,19.94 23.71,19.9 R9.2
I2C2_SDA  (via drill 0.25)
  Top 0.2: v21.72,19.94 23.55,21.77 U1.47 26.17,21.77 29.21,24.81 29.21,25.78 30.1,26.67 31.75,26.67 JP5.15
  Bottom 0.2: v21.72,19.94 20.74,19.94 R11.2
LMZ_FB
  Bottom 0.406: U3.2 15.53,32.81 R14.2 R13.1
LMZ_PG
  Bottom 0.406: U3.3 17.57,33.69 17.04,34.21 17.04,36.17 16.82,36.4 R10.1
LMZ_SS
  Bottom 0.406: U3.1 17.59,30.47 C21.1
LMZ_VIN
  Bottom 0.61: D4.C 26.25,31.27
  pour Bottom (no thermals): 22.07,33.07 24.59,33.07 24.59,36.09 26.16,36.09 26.16,33.32 27.15,32.33 27.15,29.24 26.59,28.68 26.59,27.69 25.96,27.69 25.93,27.69 24.61,29.01 23.42,29.01 23.42,30.35 22.07,31.7
N$1  (via drill 0.25)
  Top 0.2: U1.73 v12,23.97
  Bottom 0.2: v12,23.97 15.4,23.97 C9.1
N$2  (via drill 0.25)
  Top 0.2: U1.48 21.67,22.27 v21.59,22.35
  Bottom 0.2: v21.59,22.35 20.99,22.95 C12.1
N$3  (via drill 0.25)
  Top 0.2: U1.13 v17,10.57
  Bottom 0.2: v17,10.57 17,11.02 R2.1
N$4  (via drill 0.25)
  Top 0.2: U1.12 16.5,15.77 v16.3,15.97
  Bottom 0.2: Q1.3 16.52,15.97 v16.3,15.97 16.25,15.97 C17.1
N$5
  Top 0.2: R18.2 LED_DC.A
N$6  (via drill 0.25)
  Top 0.2: U1.94 v10.3,14.27
  Bottom 0.2: v10.3,14.27 9.05,14.27 R3.1
N$21  (via drill 0.25)
  Top 0.2: U1.9 15,14.77 v14.2,15.57
  Bottom 0.2: C15.1 13.25,17.37 Q2.Q2 v14.2,15.57
N$22  (via drill 0.25)
  Top 0.2: U1.8 14.5,14.07 14.3,14.27 v11,14.27
  Bottom 0.2: v11,14.27 10.75,14.52 Q2.Q1 10.75,16.97 C14.1
N$24
  Bottom 0.2: 19.73,15.02 Q1.1 | R2.2 17.65,13.22 19.38,14.95 Q1.1 | C16.1 21.43,14.95 Q1.1
N$36
  Bottom 0.61: T2.3 25.59,26.21 D3.A 21.88,26.21 R16.2
PA15
  Top 0.2: U1.77 7.71,22.77 JP2.2
PB0
  Top 0.2: U1.34 25.75,15.27 28.07,12.95 28.07,10.67 28.57,10.16 JP5.4
PB1
  Top 0.2: JP5.3 32.38,10.16 31.24,11.3 29.08,11.3 28.45,11.94 28.45,13.08 25.76,15.77 U1.35
PB2
  Top 0.2: U1.36 25.77,16.27 29.34,12.7 JP5.6
PB4
  Top 0.2: U1.90 3.57,16.27 JP2.9
PB5
  Top 0.2: U1.91 5.61,15.77 JP2.10
PC0
  Top 0.2: JP4.8 15.24,8.01 15.7,8.47 17.8,8.47 18,8.67 U1.15
PC1
  Top 0.2: U1.16 18.5,8.57 18,8.07 16.9,8.07 16.6,7.77 16.6,3.9 JP4.7
PC2
  Top 0.2: U1.17 19,7.57 17.78,6.35 JP4.10
PC3
  Top 0.2: U1.18 19.5,7.07 19.1,6.67 19.1,3.86 JP4.9
PC4
  Top 0.2: U1.32 25.73,14.27 27.3,12.7 27.3,8.64 28.32,7.62 JP5.2
PC5
  Top 0.2: JP5.1 31.75,8.89 28.45,8.89 27.69,9.65 27.69,12.83 25.74,14.77 U1.33
PC13
  Top 0.2: U1.7 14,3.84 JP4.5
PD3
  Top 0.2: U1.84 6.63,19.27 6.2,19.7 6.2,20.8 5.6,21.4 4,21.4 JP2.3
PD4
  Top 0.2: U1.85 6.63,18.77 JP2.6
PD5
  Top 0.2: JP2.5 3.66,19.2 5.7,19.2 6.63,18.27 U1.86
PD6
  Top 0.2: U1.87 6.53,17.77 5.5,18.8 3.56,18.8 JP2.7
PD7
  Top 0.2: U1.88 5.59,17.27 JP2.8
PD13
  Top 0.2: U1.60 18.5,28.62 15.24,31.88 JP1.10
PD14
  Top 0.2: U1.61 18,28.61 13.97,32.64 13.97,41.91 JP1.11
PD15
  Top 0.2: U1.62 17.5,28.6 12.7,33.4 JP1.12
PE3
  Top 0.2: U1.2 11.5,8.67 11.2,8.37 10.5,8.37 8.9,6.77 8.9,3.82 JP4.1
PE9
  Top 0.2: JP5.7 31.75,16.51 27.18,16.51 25.91,17.78 U1.39
PE10
  Top 0.2: JP5.10 26.42,17.78 25.93,18.27 U1.40
PE11
  Top 0.2: U1.41 28.42,18.77 28.83,19.18 31.62,19.18 JP5.9
PE12
  Top 0.2: U1.42 28.29,19.27 29.34,20.32 JP5.12
PE13
  Top 0.2: U1.43 28.02,19.77 29.84,21.59 31.75,21.59 JP5.11
PE14
  Top 0.2: U1.44 27.89,20.27 JP5.14
PE15
  Top 0.2: U1.45 27.63,20.77 29.08,22.23 29.08,23.24 29.97,24.13 31.75,24.13 JP5.13
SDIO_CLK  (via drill 0.25)
  Top 0.2: U1.80 7.7,21.27 v6.9,22.07 | v6.9,34.09 K2.CLK
  Bottom 0.2: v6.9,22.07 v6.9,34.09
SDIO_CMD  (via drill 0.25)
  Top 0.2: U1.83 v6.8,19.77 | K2.CMD v6.35,31.89 v7.9,31.89
  Bottom 0.2: v6.8,19.77 6.35,20.22 v6.35,31.89 | R5.2 8.27,31.89 v7.9,31.89
SDIO_D0  (via drill 0.25)
  Top 0.2: 5.7,36.29 K2.DAT0 6.91,36.29 v7.6,35.6 8.37,35.6 12.19,31.78 12.19,29.34 14.16,27.36 v14.7,27.36 | U1.65 v16,27.36
  Bottom 0.2: v16,27.36 v14.7,27.36 | R6.2 8.42,35.6 v7.6,35.6
SDIO_D1  (via drill 0.25)
  Top 0.2: U1.66 15.5,27.43 12.7,30.23 12.7,31.88 7.18,37.39 K2.DAT1 v7.25,37.39
  Bottom 0.2: R7.2 8.68,37.39 v7.25,37.39
SDIO_D2  (via drill 0.25)
  Top 0.2: U1.78 v8.1,22.27 | v8.1,29.69 K2.DAT2
  Bottom 0.2: v8.1,22.27 8.1,28.6 | 8.1,28.6 v8.1,29.69 | R22.2 9.12,28.6 8.1,28.6
SDIO_D3  (via drill 0.25)
  Top 0.2: U1.79 7.9,21.77 v7.5,22.17 | v7.5,30.79 K2.CD/DAT3
  Bottom 0.2: v7.5,22.17 v7.5,30.79 9.03,30.79 R4.2
SPI1_MISO
  Top 0.2: U1.30 25.59,13.27 26.54,12.32 26.54,10.79 26.16,10.41 26.16,6.86 JP4.18
SPI1_MOSI
  Top 0.2: U1.31 25.73,13.77 26.92,12.57 26.92,7.75 29.08,5.59 29.08,3.94 27.94,2.79 JP4.17
SPI1_NSS
  Top 0.2: JP4.16 25.4,10.67 25.78,11.05 25.78,11.94 25.45,12.27 U1.28
SPI1_SCK
  Top 0.2: U1.29 25.46,12.77 26.16,12.06 26.16,10.92 25.78,10.54 25.78,6.22 26.67,5.33 26.67,3.81 JP4.15
SPI2_MISO
  Top 0.2: U1.53 22,26.95 24.26,29.21 24.26,29.96 24.26,41.78 JP1.3
SPI2_MOSI
  Top 0.2: U1.54 21.5,27.09 22.86,28.45 JP1.4
SPI2_NSS
  Top 0.2: U1.51 23,26.66 25.4,29.06 25.4,39 26.67,40.27 26.67,41.91 JP1.1
SPI2_SCK
  Top 0.2: U1.52 22.5,26.82 25.02,29.34 25.02,40.26 JP1.2
SPI4_MISO
  Top 0.2: U1.4 12.5,8.07 11.6,7.17 11.6,3.98 JP4.3
SPI4_MOSI
  Top 0.2: U1.5 13,5.38 JP4.6
SPI4_NSS
  Top 0.2: U1.3 12,8.19 10.16,6.35 JP4.4
SPI4_SCK
  Top 0.2: U1.1 7.62,6.14 JP4.2
SUPPLY
  Bottom 0.61: JP5.18 30.48,28.15 T2.6 | T2.6 T2.5 | T2.6 T2.1 T2.2
SWCLK  (via drill 0.25)
  Top 0.2: U1.76 17.81,23.27 v18.29,23.75 | v30.96,35.56 J1.4 26.9,35.56 26.8,35.46 26.8,28.76 24.51,26.47 v24.51,24
  Bottom 0.2: v18.29,23.75 18.54,24 v24.51,24 | 30.82,35.56 v30.96,35.56 31.85,36.45 R21.2
SWDIO  (via drill 0.25)
  Top 0.2: U1.72 12.5,23.87 12.7,23.67 17.32,23.67 v17.4,23.75 | 28.42,34.26 28.48,34.26 | 28.48,34.26 v30.96,34.26 | v25.02,25.27 25.02,26.23 27.2,28.41 27.2,33.04 28.42,34.26 | 28.48,34.26 28.51,34.29 J1.2 | 28.42,34.26 28.4,34.28 28.4,34.3
  Bottom 0.2: v25.02,25.27 18.92,25.27 v17.4,23.75 | 30.87,34.26 v30.96,34.26 31.12,34.42 R8.2
SWO  (via drill 0.25)
  Top 0.2: U1.89 15.8,16.77 17.1,18.07 17.1,22.56 v17.14,22.61 | v30.96,36.86 30.93,36.83 J1.6 26.57,36.83 26.4,36.66 26.4,28.86 23.88,26.34 23.88,24.13 22.73,22.99 v19.18,22.99
  Bottom 0.2: v19.18,22.99 17.53,22.99 v17.14,22.61 | 30.93,36.86 v30.96,36.86 30.96,38.3 31.14,38.48 R20.2
UART7_RX
  Top 0.2: JP5.5 31.75,13.97 28.57,13.97 25.77,16.77 U1.37
UART7_TX
  Top 0.2: U1.38 25.78,17.27 27.81,15.24 JP5.8
UART8_RX
  Top 0.2: U1.97 7.3,12.77 6.9,12.37 6.9,9.4 6.39,8.89 3.81,8.89 JP2.15
UART8_TX
  Top 0.2: U1.98 7.4,12.27 7.3,12.17 7.3,9.2 5.72,7.62 JP2.16
USART1_CK  (via drill 0.25)
  Top 0.2: U1.67 v15,26.73
  Bottom 0.2: v15,26.73 13.78,26.73 12.1,28.41 12.1,38.1 11.6,38.6 9.66,38.6 JP1.16
USART1_RX
  Top 0.2: U1.93 7.15,14.77 JP2.12
USART1_TX
  Top 0.2: U1.92 6.77,15.27 5.5,14 3.84,14 JP2.11
USART2_CTS
  Top 0.2: U1.22 21.5,8.77 20.32,7.59 JP4.12
USART2_RTS
  Top 0.2: U1.23 22,7.47 21.6,7.07 21.6,3.82 JP4.11
USART2_RX
  Top 0.2: U1.25 23,7.87 24,6.87 24,3.68 JP4.13
USART2_TX
  Top 0.2: U1.24 22.5,5.44 JP4.14
USART3_CK
  Top 0.2: U1.57 20,28.64 19.05,29.59 19.05,41.91 JP1.7
USART3_CTS
  Top 0.2: U1.58 19.5,28.63 17.78,30.35 JP1.8
USART3_RTS
  Top 0.2: U1.59 19,28.62 16.51,31.11 16.51,41.91 JP1.9
USART3_RX
  Top 0.2: U1.56 20.5,28.65 19.45,29.7 19.45,39.77 JP1.6 20.32,40.42
USART3_TX
  Top 0.2: U1.55 21,27.48 21.59,28.07 21.59,41.91 JP1.5
USART6_RX
  Top 0.2: U1.64 16.5,28.59 10.16,34.92 JP1.14
USART6_TX
  Top 0.2: U1.63 17,28.59 11.43,34.16 11.43,41.91 JP1.13
USB_DM  (via drill 0.25)
  Top 0.2: U5.4 10.78,31.92 9.11,33.59 v6.1,33.59
  Bottom 0.2: K1.D- 5.95,33.44 v6.1,33.59
USB_DP  (via drill 0.25)
  Top 0.2: v6,32.39 8.71,32.39 9.48,31.62 U5.6
  Bottom 0.2: K1.D+ 5.1,32.79 5.5,32.39 v6,32.39
USB_OTG_FS_DM
  Top 0.2: U1.70 13.5,26.3 U5.3
USB_OTG_FS_DP
  Top 0.2: U1.71 13,26.27 12.5,26.77 10.73,26.77 9.48,28.02 U5.1
USB_OTG_FS_ID  (via drill 0.25)
  Top 0.2: v3,31.79 3,30.29 7.22,26.07 v10,26.07 | v14,26.07 U1.69
  Bottom 0.2: K1.ID 3.35,32.14 v3,31.79 | v10,26.07 v14,26.07
USB_OTG_FS_VBUS  (via drill 0.25)
  Top 0.2: U1.68 14.5,26.27 11.67,29.09 11.67,31.63 8.71,34.59 v6.1,34.59
  Bottom 0.2: K1.VCC 5.6,34.09 v6.1,34.59